# EAGLE design Adafruit EZ-Key Breakout (EAGLE 6.3)
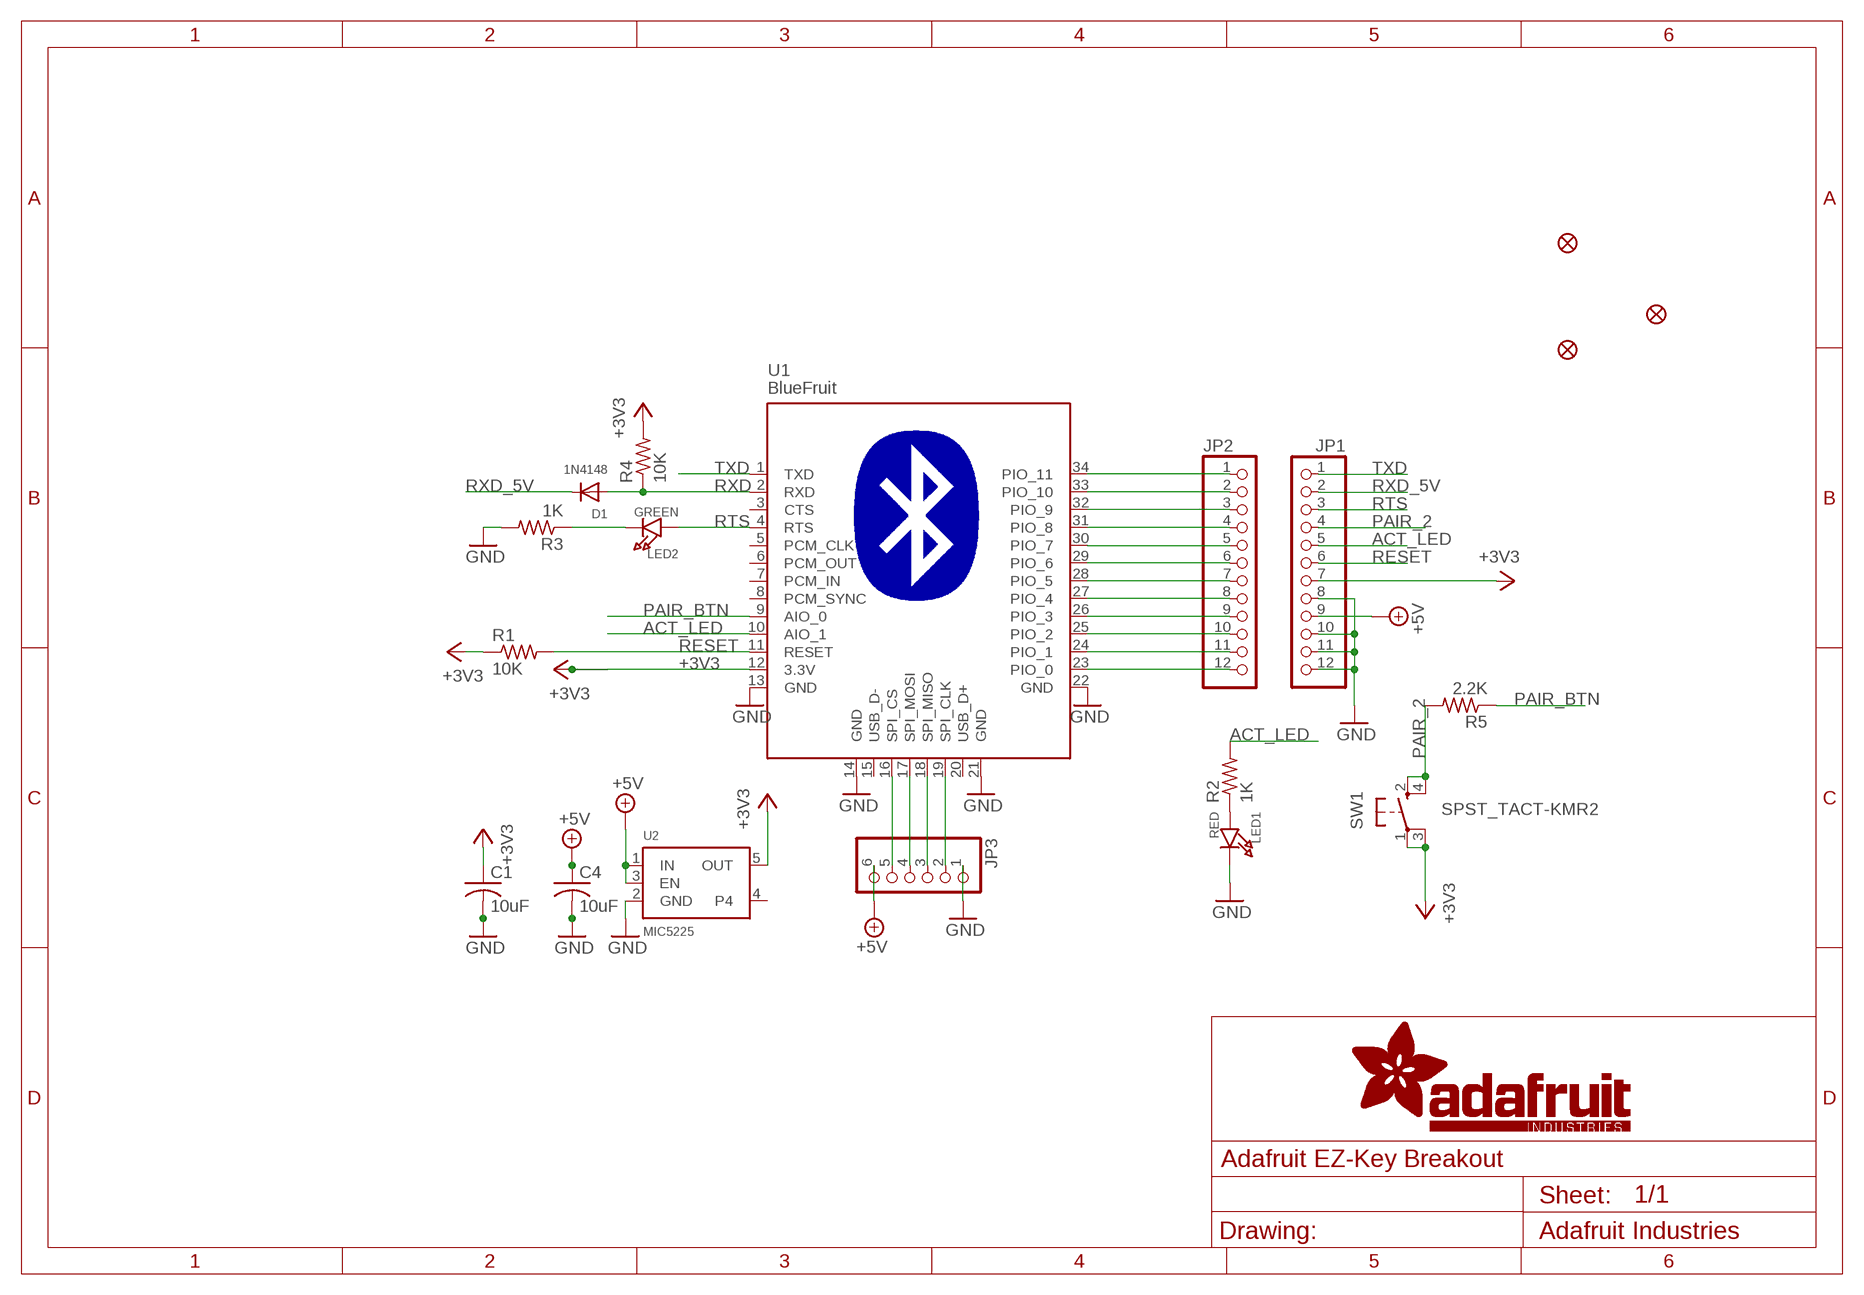
[diagram p0: schematic, sheet 1]

## Parts
C1  10uF  C-USC0805  [C0805]
C4  10uF  C-USC0805  [C0805]
D1  1N4148  DIODESOD-323  [SOD-323]
FID1  FIDUCIAL""  [FIDUCIAL_1MM]
FID2  FIDUCIAL""  [FIDUCIAL_1MM]
FID3  FIDUCIAL""  [FIDUCIAL_1MM]
JP1  PINHD-1X12-CB  [1X12-CB]
JP2  PINHD-1X12-CB  [1X12-CB]
JP3  PINHD-1X6B  [1X06-BIG]
LED1  RED  LED0805_NOOUTLINE  [CHIPLED_0805_NOOUTLINE]
LED2  GREEN  LED0805_NOOUTLINE  [CHIPLED_0805_NOOUTLINE]
R1  10K  R-US_R0805  [R0805]
R2  1K  R-US_R0805  [R0805]
R3  1K  R-US_R0805  [R0805]
R4  10K  R-US_R0805  [R0805]
R5  2.2K  R-US_R0805  [R0805]
SW1  SPST_TACT-KMR2  [KMR2]
U1  BlueFruit  BLUETOOTH_MODULE  [BLUETOOTH_MODULE]
U2  MIC5225  VREG_SOT23-5  [SOT23-5]

## Nets
+3V3: C1.1 JP1.7 R1.1 R4.2 SW1.1(P) SW1.3(P1) U1.12(3.3V) U2.5(OUT)
+5V: C4.1 JP1.9 JP3.6 U2.1(IN) U2.3(EN)
ACT_LED: JP1.5 R2.2 U1.10(AIO_1)
CLK: JP3.2 U1.19(SPI_CLK)
CS: JP3.5 U1.16(SPI_CS)
GND: C1.2 C4.2 JP1.8 JP1.10 JP1.11 JP1.12 JP3.1 LED1.C R3.2 U1.13(GND) U1.14(GND) U1.21(GND) U1.22(GND) U2.2(GND)
MISO: JP3.3 U1.18(SPI_MISO)
MOSI: JP3.4 U1.17(SPI_MOSI)
N$1: JP2.5 U1.30(PIO_7)
N$2: LED1.A R2.1
N$3: LED2.C R3.1
N$23: JP2.12 U1.23(PIO_0)
N$24: JP2.11 U1.24(PIO_1)
N$25: JP2.10 U1.25(PIO_2)
N$26: JP2.9 U1.26(PIO_3)
N$27: JP2.8 U1.27(PIO_4)
N$28: JP2.7 U1.28(PIO_5)
N$29: JP2.6 U1.29(PIO_6)
N$31: JP2.4 U1.31(PIO_8)
N$32: JP2.3 U1.32(PIO_9)
N$33: JP2.2 U1.33(PIO_10)
N$34: JP2.1 U1.34(PIO_11)
PAIR_2: JP1.4 R5.2 SW1.2(S) SW1.4(S1)
PAIR_BTN: R5.1 U1.9(AIO_0)
RESET: JP1.6 R1.2 U1.11(RESET)
RTS: JP1.3 LED2.A U1.4(RTS)
RXD: D1.A R4.1 U1.2(RXD)
RXD_5V: D1.C JP1.2
TXD: JP1.1 U1.1(TXD)
Unconnected: U1.3(CTS) U1.5(PCM_CLK) U1.6(PCM_OUT) U1.7(PCM_IN) U1.8(PCM_SYNC) U1.15(USB_D-) U1.20(USB_D+) U2.4

## Library data of the parts
C1 C4 = rcl:C-US: CAPACITOR, American symbol
D1 = microbuilder:DIODE: Diode SMA Model Volts Amps Type Vf Vr Digikey # Notes SSA34-E3 40V 3A Schottky 480mV @ 3A 200uA @ 40V SSA34-E3/61TGITR-ND CDBA120-G 20V 1A Schottky 500mV @ 1A 500uA @ 20V 641-1014-6-ND REEL MBRA210 10V 2A Schottky 350mV @ 2A 700uA @ 10V MBRA210LT3 SOD-123 Model Volts Amps Type Vf Vr Order # Notes BAT54T1G 30V 200mA Schottky 800mV @ 200mA 2uA @ 25V BAT54T1GOSTR-ND B0530W 30V 500mA Schottky 430mV @ 500mA 130uA @ 30V B0530W-FDICT-ND REEL MBR120 20V 1A Schottky 340mV @ 1A MBR120VLSFT1GOSCT-ND SOD-323 Model Volts Amps Type Vf Vr Order # Notes PMEG2005EJ 20V 500mA Schottky 355mV @ 500mA 568-4110-1-ND ZLLS410 10V 570mA Schottky 380mV @ 570mA ZLLS410CT-ND 1N4148WS 75V 150mA Silicon/Simple 1V 1N4148WSFSCT-ND REEL SOD-523 Model Volts Amps Type Vf Vr Order # Notes BAT54XV2 30V 200mA Schottky 0.8V @ 100mA BAT54XV2CT-ND TB751S 30V 30mA Schottky RB751S-40TE61CT-ND SOT23-R/W (R = Solder Paste/Reflow Ovens, W = Hand-Soldering) Model Volts Amps Type Vf Vr Order # Notes BAT54FILM 40V 300mA Schottky 497-7162-1-ND
FID1-FID3 = microbuilder:FIDUCIAL: Fiducial Alignment Points Various fiducial points for machine vision alignment.; BOM: EXCLUDE
JP1 JP2 = adafruit:PINHD-1X12: PIN HEADER
JP3 = adafruit:PINHD-1X6: PIN HEADER
LED1 LED2 = microbuilder:LED: LED 0603 - 0603 Surface Mount Package 2mA: Green LED - Low Power (3.9mcd, 2ma, 1.7Vf) - Digikey: 475-2709-2-ND Orange LED - Low Power (9.8mcd, 2ma, 1.8Vf) - Digikey: 475-1194-2-ND Red LED - Low Power (5mcd, 2ma, 1.8Vf) - Digikey: 475-1195-2-ND Yellow LED - Low Power (7mcd, 2ma, 1.8Vf) - Digikey: 475-1196-2-ND 5mA: Blue LED - Low Power (17mcd, 5ma, 2.9Vf) - Digikey: LNJ937W8CRACT-ND 0805 - 0805 Surface Mount Package 2mA: Red LED (8.8mcd, 2mA, 1.8Vf, Clear) - Low Power [Digikey: 475-2510-1-ND] Green LED (5mcd, 2mA, 1.8Vf, Clear) - Low Power [Digikey: 475-2730-1-ND] Yellow LED (11.3mcd, 2mA, 1.8Vf, Clear) - Low Power [Digikey: 475-2555-1-ND] 20mA: Red LED (104mcd, 20mA, Diffused) - LS R976 [Digikey: 475-1278-6-ND] Red LED (12mcd, 20mA, 2.0Vf, Clear) - APT2012EC [Digikey: 754-1128-1-ND] Green LED (15mcd, 20mA, 2.2Vf, Clear) - APT2012GC [Digikey: 754-1131-1-ND] Orange LED (160mcd, 20mA, 2.1Vf, Clear) - APT2012SECK [Digikey: 754-1130-1-ND] 1206 - 1206 Surface Mount Package Green LED (26mcd, 20mA, Diffused) - LG N971 [Digikey: 475-1407-6-ND] Red LED (15mcd, 20mA, Diffused) - LH N974 [Digikey: 475-1416-6-ND] Cree - Cree High-Power Surface Mount LEDs XPEBWT-L1-0000-00D50 - White 111lm 350mA 2.9Vf 6200K 110° XTEAWT-00-0000-00000LEE3 - White 114lm 350mA 2.85Vf 5000K 115° Everlight - Everlight 45-21 Series Surface Mount LEDs 45-21/QK2C-B2832AC2CB2/2T - Warm White 2000mcd 20mA 3.25Vf 3050K 120° 45-21/LK2C-B38452C4CB2/2T - Nuetral White 2000mcd 20mA 3.25Vf 4150K 120° 45-21/LK2C-B50634C6CB2/2T - Cold White 2200mcd 20mA 3.25Vf 5650K 120° PLCC2 Reverse Mount LS T77K-J1L2-1-0-2-R18-Z - Red 11.25mcd 2mA 1.8Vf 630nm 120° LO T77K-L1M2-24-Z - Orange 19.6mcd 2mA 1.8Vf 606nm 120° LY T77K-K2M1-26-Z - Yellow 15.7mcd 2mA 1.8Vf 587nm 120°
R1-R5 = rcl:R-US_: RESISTOR, American symbol
SW1 = adafruit:SPST_TACT: SMT 6mm switch, EVQQ2 series http://www.ladyada.net/library/eagle
U1 = microbuilder:BLUETOOTH_MODULE: BLUETOOTH MODULE
U2 = microbuilder:VREG_SOT23-5: SOT23-5 Fixed Voltage Regulators Part Current Out V Out V In V Dropout θJA (°C/W) TJ (°C) Digikey Part No. ADP121 150mA 3.3V 3.4-5.5V 0.09V @ 150mA -- -- ADP121-AUJZ33R7CT-ND ADP121 150mA 3.0V 3.1-5.5V 0.09V @ 150mA -- -- ADP121-AUJZ30R7CT-ND ADP122 300mA 3.3V 3.4-5.5V 0.085V @ 300mA -- -- ADP122AUJZ-3.3-R7CT-ND ADP1712 300mA 3.3V 3.5-5.5V 0.17V @ 300mA -- -- ADP1712AUJZ-3.3-R7TR-ND AP7311 (Low Cost) 150mA 3.3V 3.5-6V 0.15V @ 150mA -- -- AP7311-33WG-7DICT-ND LD39015M18R 150mA 1.8V 1.9V-5.5V 0.08V @ 100mA -- -- 497-6977-1-ND LP2985A-33DBVR 150mA 3.3V 3.3-16V 0.28V @ 150mA 206 150 296-18479-1-ND MCP1824T-3302E/OT 300mA 3.3V 3.5V-6V 0.2V @ 300mA -- -- MCP1824T-3302E/OTCT-ND MIC5205-2.5YM5 TR 150mA 2.5V 2.7-16V 0.165V @ 150mA -- -- 576-1257-2-ND MIC5205-3.0YM5 TR 150mA 3.0V 3.2V-16V 0.165V @ 150mA -- -- 576-1258-2-ND MIC5205-3.3YM5 TR 150mA 3.3V 3.5V-16V 0.165V @ 150mA -- -- 576-1259-2-ND TPS780330220 150mA 3.3V+2.2V 3.6-5.5V 250mV Max -- -- 296-23332-1-ND TDA3663/N1,135 100mA 3.3V 3.5-45V 0.18V @ 50mA -- -- 568-5343-1-ND Max operating temp can be calculated using θJA, TJ (max junction temperature), and power in watts. Set the "Maximum Ambient Temperature" until it reaches TJ ("Max Junction Temperature"), which is the absolute limit for safe use of the regulator: Heat Sink Temperature Calculator <http://www.daycounter.com/Calculators/Heat-Sink-Temperature-Calculator.phtml> For example, With 12V source into a 3.3V LP2985 and a 30mA load, we are dissipating (12V-3.3V) * 0.03A = 0.261W. With a θJA of 206 °C/W, a TJ of 150°C, and 261mW we can safely use the chip without a heat sink up to 75°C (=147.1°C Junction Temperature).

## Board
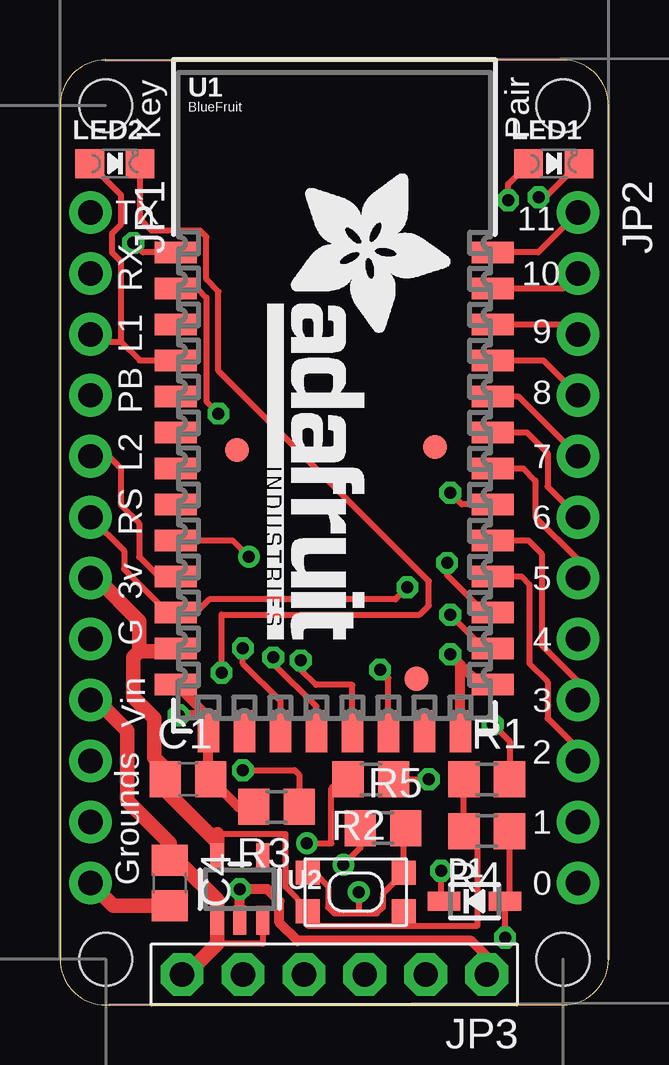
[diagram p1: board, top side]
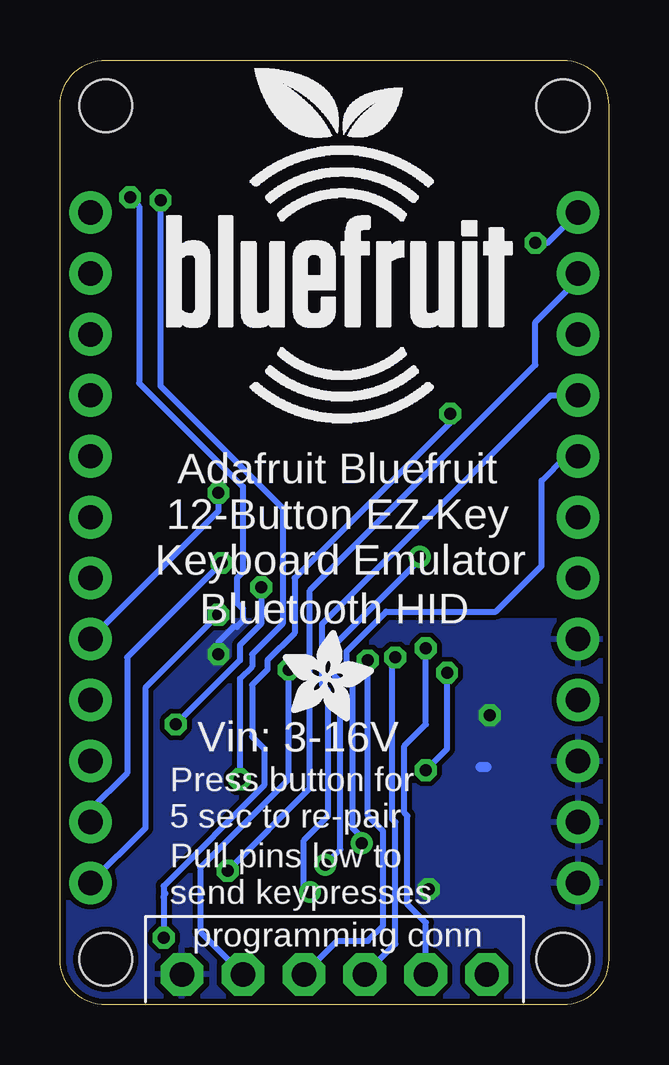
[diagram p2: board, bottom side, seen from below]

Size 22.86 x 39.37 mm. Coordinates in mm from the lower left corner, seen from the top.
Outline: 1.91,0 20.95,0 arc90 22.86,1.91 22.86,37.47 arc90 20.95,39.37 1.91,39.37 arc90 0,37.47 0,1.91 arc90 1.91,0
Copper layers (1*16): Top 0.035mm / dielectric 1.5mm / Bottom 0.035mm
Design rules "adafruit *": minimum track width 8mil, minimum drill 16mil, track to track 8mil, track to pad 8mil, pad to pad 8mil, via to via 8mil, smd to smd 8mil, copper to edge 10mil, drill to drill 8mil, minimum pad ring 10mil, minimum via ring 8mil, stop-mask expansion 4mil, vias tented up to drill 20mil, thermal gap 10mil
Holes 2.2 mm at 1.91,1.91 20.95,1.91 1.91,37.47 20.95,37.47

### Footprints (pad centres in the part's own frame; a part is rotated, then mirrored left to right if it is on the bottom)
C0805 = smd 1.3 x 1.5: 1 -0.95,0; 2 0.95,0
SOD-323 = smd 1.35 x 0.8: A 1.27,0; C -1.27,0
FIDUCIAL_1MM = smd 1 x 1: 1 0,0
1X12-CB = drill 1.016 pad 1.778: 1 -13.97,0; 2 -11.43,0; 3 -8.89,0; 4 -6.35,0; 5 -3.81,0; 6 -1.27,0; 7 1.27,0; 8 3.81,0; 9 6.35,0; 10 8.89,0; 11 11.43,0; 12 13.97,0
1X06-BIG = drill 1.016 pad 1.778 octagon: 1 -6.35,0; 2 -3.81,0; 3 -1.27,0; 4 1.27,0; 5 3.81,0; 6 6.35,0
CHIPLED_0805_NOOUTLINE = smd 1.2 x 1.2: A 0,-1.05; C 0,1.05
R0805 = smd 1.3 x 1.5: 1 -0.95,0; 2 0.95,0
KMR2 = smd 1 x 1: 1 2,0.8; 2 2,-0.8; 3 -2,0.8; 4 -2,-0.8
BLUETOOTH_MODULE = smd 1.75 x 0.9: 1 -6.6,5.95; 2 -6.6,4.45; 3 -6.6,2.95; 4 -6.6,1.45; 5 -6.6,-0.05; 6 -6.6,-1.55; 7 -6.6,-3.05; 8 -6.6,-4.55; 9 -6.6,-6.05; 10 -6.6,-7.55; 11 -6.6,-9.05; 12 -6.6,-10.55; 13 -6.6,-12.05; 22 6.6,-12.05; 23 6.6,-10.55; 24 6.6,-9.05; 25 6.6,-7.55; 26 6.6,-6.05; 27 6.6,-4.55; 28 6.6,-3.05; 29 6.6,-1.55; 30 6.6,-0.05; 31 6.6,1.45; 32 6.6,2.95; 33 6.6,4.45; 34 6.6,5.95 | smd 0.9 x 1.75: 14 -5.25,-14; 15 -3.75,-14; 16 -2.25,-14; 17 -0.75,-14; 18 0.75,-14; 19 2.25,-14; 20 3.75,-14; 21 5.25,-14
SOT23-5 = smd 0.55 x 1.2: 1 -0.95,-1.3; 2 0,-1.3; 3 0.95,-1.3; 4 0.95,1.3; 5 -0.95,1.3

### Placement (x,y rotation side)
C1  5.33,9.4 0 top
C4  4.57,5.08 270 top
D1  17.27,4.32 0 top
FID1  7.37,23.11 0 top
FID2  14.86,13.59 0 top
FID3  15.62,23.24 0 top
JP1  1.27,19.05 270 top
JP2  21.59,19.05 270 top
JP3  11.43,1.27 180 top
LED1  20.57,35.05 270 top
LED2  2.29,35.05 270 top
R1  17.78,9.4 0 top
R2  12.95,9.4 180 top
R3  9.02,8.26 180 top
R4  17.78,7.24 180 top
R5  13.46,7.37 0 top
SW1  12.32,4.7 180 top
U1  11.43,25.4 0 top
U2  7.49,4.83 0 top
U$2  [BLUEFRUITLOGO_150MM]  18.41,24.26 0 bottom
U$3  [ADAFRUIT_3.5MM]  13.59,11.81 0 bottom
U$4  [ADAFRUIT_TEXT_20MM]  8.64,34.8 270 top

### Tracks (layer width: path | path; a pad name or v marks a point on that pad's centre or on a via)
+3V3
  Top 0.254: R1.1 R4.2 17.4,6.67 17.4,3.3 14.32,3.3 | 6.54,7.11 9.4,7.11 9.4,4.92 10.32,3.99 SW1.1 10.32,3.3 14.32,3.3 | SW1.3 14.32,3.3
  Top 0.406: C1.1 4.38,8.95 | 6.48,6.86 6.54,6.86
  Top 0.61: 3.31,14.74 3.05,14.48 3.05,12.83 3.94,11.94 3.94,10.29 4.38,9.84 C1.1 | 4.38,8.95 6.48,6.86 | 6.54,7.11 6.54,6.86 U2.5 | 3.31,14.74 4.83,14.74 U1.12 | 3.31,14.74 3.31,15.99 1.52,17.78 JP1.7
+5V
  Top 0.254: U2.3 8.44,2.54 6.54,2.54
  Top 0.61: JP1.9 1.52,12.7 2.79,11.43 2.79,8.51 4.57,6.73 C4.1 | C4.1 4.83,6.03 | C4.1 4.89,5.71 5.21,5.71 6.54,4.38 U2.1 6.54,2.54 5.27,1.27 JP3.6
ACT_LED  (via drill 0.5)
  Top 0.254: JP1.5 2.03,22.86 2.54,22.35 2.54,20.83 3.3,20.07 3.3,18.67 4.12,17.85 U1.10 | v10.29,6.73 11.3,6.73 11.3,9.02 11.68,9.4 R2.2
  Bottom 0.254: JP1.5 1.78,22.86 2.79,21.84 2.79,18.29 4.7,16.38 9.27,16.38 10.92,14.73 10.92,13.97 10.67,13.72 10.67,7.37 10.29,6.99 v10.29,6.73
CLK  (via drill 0.5)
  Top 0.254: U1.19 13.68,13.62 v13.34,13.97
  Bottom 0.254: JP3.2 17.02,3.05 17.02,5.71 13.34,9.4 v13.34,13.97
CS  (via drill 0.5)
  Top 0.254: v7.62,14.86 7.62,14.22 9.18,12.66 U1.16
  Bottom 0.254: JP3.5 7.62,3.43 8.38,4.19 8.38,7.87 8.51,8 8.51,10.79 7.62,11.68 v7.62,14.86
GND  (via drill 0.5)
  Top 0.254: 21.59,35.31 21.59,35.27 21.62,35.24 LED1.C 20.23,33.66 v19.94,33.66 | 6.2,9.4 C1.2 6.18,9.5 6.18,9.68
  Top 0.406: 6.18,9.68 U1.14 6.18,12.06 6.1,12.06 | 6.1,12.06 v4.95,12.06 | U2.2 v7.49,4.83 8.64,4.83 9.14,4.32 9.14,3.43 9.91,2.67 17.14,2.67 17.78,2.03 JP3.1 | U1.21 16.68,14.18 | 16.68,14.18 v16.26,14.61 | U1.13 6.1,12.08 6.1,12.06 | 16.68,14.18 17.51,13.35 U1.22 | C1.2 7.43,8.26 R3.2
  Top 0.61: JP1.12 2.22,4.13 C4.2
  Bottom 0.254: v19.94,33.66 19.56,33.27 19.56,25.91 15.24,21.59 15.24,18.03 15.49,17.78 15.49,16.76 15.24,16.51 15.24,16 15.49,15.75 15.62,15.75 16.26,15.11 v16.26,14.61
  Bottom 0.406: 5.08,9.91 5.33,9.91
  pour Bottom: 0.25,16 0.25,0 23.62,0 23.62,16
MISO  (via drill 0.5)
  Top 0.254: U1.18 12.18,13.34 10.67,13.34 10.03,13.97 v10.03,14.35
  Bottom 0.254: JP3.3 11.3,2.67 10.03,2.67 9.4,3.3 9.4,7.24 10.03,7.87 v10.03,14.35
MOSI  (via drill 0.5)
  Top 0.254: U1.17 10.68,12.43 8.89,14.22 v8.89,14.48
  Bottom 0.254: JP3.4 8.89,2.54 8.89,7.62 9.02,7.75 9.02,14.22 8.89,14.35 v8.89,14.48
N$1
  Top 0.254: U1.30 19.1,25.35 JP2.5
N$2  (via drill 0.5)
  Top 0.254: 15.37,9.59 v15.37,9.4 R2.1 | v18.67,33.53 18.67,34.2 LED1.A
  Bottom 0.254: v18.67,33.53 18.67,25.78 13.59,20.7 13.59,15.88 14.86,14.61 14.86,14.1 15.37,13.59 v15.37,9.4
N$3  (via drill 0.5)
  Top 0.254: v6.73,13.84 6.73,16.26 14.99,16.26 15.37,16.64 15.37,17.65 6.6,26.42 6.6,29.72 6.1,30.23 6.1,32 5.84,32.26 3.81,32.26 3.34,32.73 LED2.C | v7.62,9.78 9.78,9.78 9.97,9.59 R3.1
  Bottom 0.254: v7.62,9.78 6.73,10.67 v6.73,13.84
N$23  (via drill 0.5)
  Top 0.254: v16.26,16.26 17.66,14.85 U1.23
  Bottom 0.254: v16.26,16.26 19.3,13.21 19.3,7.37 JP2.12
N$24  (via drill 0.5)
  Top 0.254: v16.13,18.41 16.13,17.91 17.69,16.35 U1.24
  Bottom 0.254: v16.13,18.41 20.07,14.48 20.07,9.65 21.59,8.13 JP2.11
N$25
  Top 0.254: JP2.10 21.59,10.67 20.32,11.94 20.32,13.46 19.56,14.22 19.56,17.53 19.23,17.85 U1.25
N$26
  Top 0.254: JP2.9 21.59,13.46 20.07,14.99 20.07,18.8 19.51,19.35 U1.26
N$27  (via drill 0.5)
  Top 0.254: U1.27 16.74,20.85 v16.26,21.34
  Bottom 0.254: v16.26,21.34 16.26,20.57 JP2.8
N$28
  Top 0.254: JP2.7 21.59,18.54 19.81,20.32 19.81,21.84 19.31,22.35 U1.28
N$29
  Top 0.254: JP2.6 20.32,21.59 20.32,22.99 19.46,23.85 U1.29
N$31
  Top 0.254: 21.59,25.65 JP2.4 20.14,26.85 U1.31
N$32
  Top 0.254: U1.32 21.18,28.35 JP2.3
N$33
  Top 0.254: U1.33 20.96,29.85 JP2.2
N$34
  Top 0.254: JP2.1 19.92,31.35 U1.34
PAIR_2  (via drill 0.5)
  Top 0.254: SW1.2 10.63,5.5 11.18,4.95 11.18,4.06 11.43,3.81 12.45,3.81 | 12.45,3.81 13.21,3.81 13.46,4.06 13.46,4.64 SW1.4 14.32,7.27 R5.2 | v12.45,4.7 12.45,3.81
  Bottom 0.254: v12.45,4.7 12.7,4.95 12.7,6.86 11.68,7.87 11.68,13.08 11.94,13.34 11.94,15.88 2.41,25.4 JP1.4
PAIR_BTN  (via drill 0.5)
  Top 0.254: R5.1 12.51,6.54 v11.81,5.84 | U1.9 7.19,19.35 v7.87,18.67
  Bottom 0.254: v11.81,5.84 11.18,6.48 11.18,13.46 11.43,13.72 11.43,14.99 7.87,18.54 v7.87,18.67
RESET  (via drill 0.5)
  Top 0.254: JP1.6 2.67,18.92 2.67,18.16 4.48,16.35 U1.11 5.68,16.35 6.22,16.89 13.97,16.89 v14.48,17.4 | v18.03,11.68 18.73,10.99 R1.2
  Bottom 0.254: v14.48,17.4 14.48,15.88 15.37,14.99 15.37,14.35 v18.03,11.68
RTS
  Top 0.254: JP1.3 1.58,27.63 2.54,27.63 | LED2.A 2.54,33.75 2.54,32.51 2.16,32.13 2.16,31.37 2.54,30.99 2.54,27.63 | 2.54,27.63 3.32,26.85 U1.4
RXD  (via drill 0.5)
  Top 0.254: R4.1 18.73,4.51 D1.A v18.54,2.79 | U1.2 5.71,29.85 6.1,29.46 6.1,25.15 v6.6,24.64
  Bottom 0.254: 18.47,4.65 arc-45 18.54,4.47 v18.54,2.79 18.54,4.95 14.35,9.14 14.35,10.67 14.86,11.18 14.86,13.34 14.22,13.97 14.22,14.35 13.08,15.49 13.08,17.78 6.6,24.26 v6.6,24.64
RXD_5V  (via drill 0.5)
  Top 0.254: D1.C 15.88,4.45 v15.88,5.59
  Bottom 0.254: JP1.2 1.27,30.23 3.05,28.45 3.05,26.67 12.45,17.27 12.45,9.02 v15.88,5.59
TXD  (via drill 0.5)
  Top 0.254: U1.1 3.45,31.35 v3.05,31.75
  Bottom 0.254: JP1.1 2.54,31.75 v3.05,31.75

### Text on the board
tPlace: Key | Pair | TX | 11 | 10 | RX | 9 | L1 | PB | 8 | L2 | 7 | RS | 6 | 3v | 5 | G | 4 | Vin | 3 | Grounds | 2 | 1 | 0
bPlace: Adafruit Bluefruit | 12-Button EZ-Key | Keyboard Emulator | Bluetooth HID | Vin: 3-16V | Press button for / 5 sec to re-pair | Pull pins low to / send keypresses | programming conn